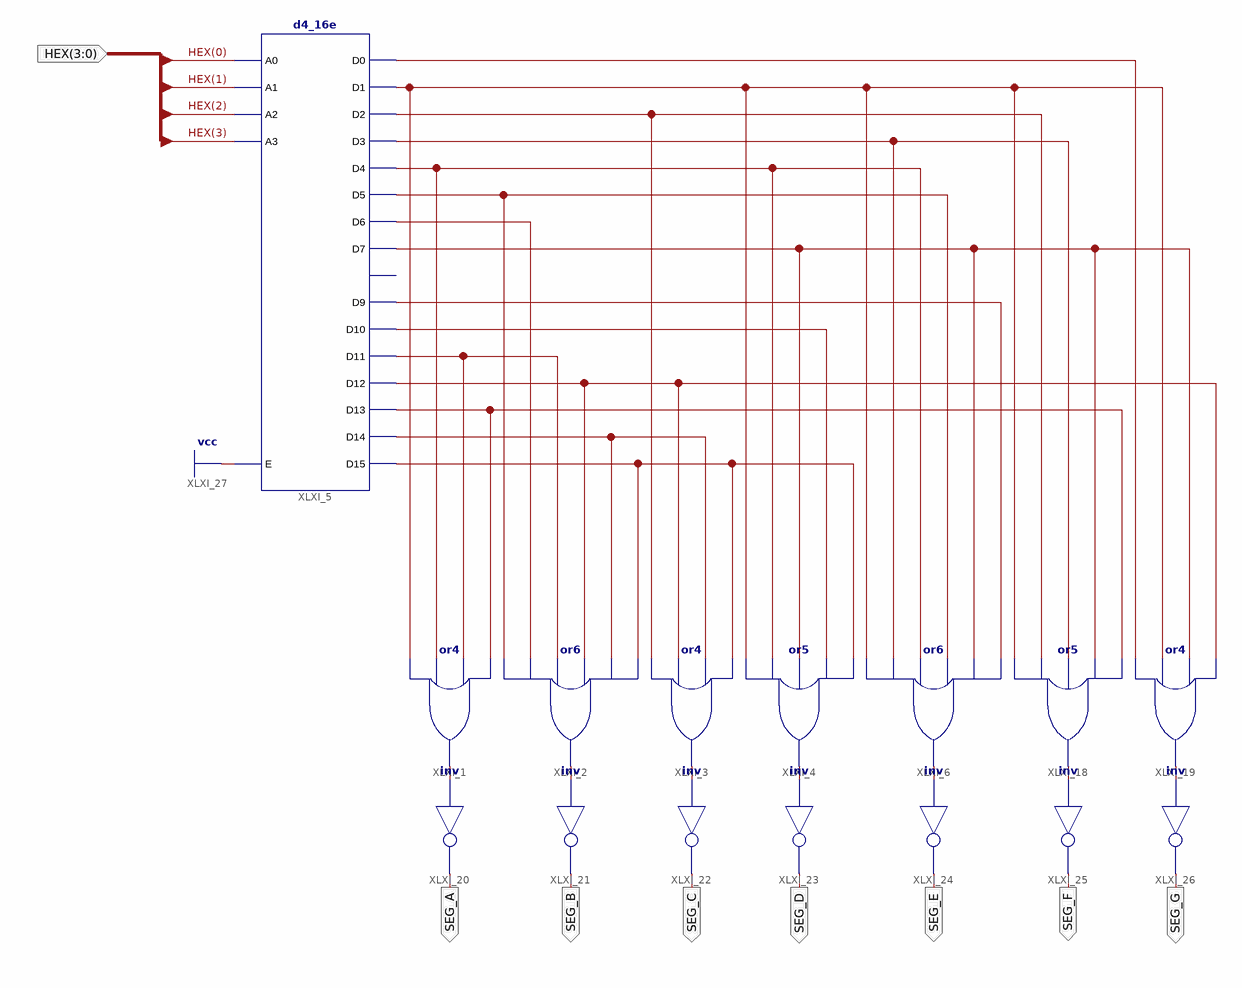
[diagram p0: schematic sheet 1]
// Xilinx ISE schematic HEX27SEG_Bus.sch (spartan6) as structural Verilog: 15 symbols, 8 ports
module HEX27SEG_Bus (
  input  [3:0] HEX,
  output SEG_A,
  output SEG_B,
  output SEG_C,
  output SEG_D,
  output SEG_E,
  output SEG_F,
  output SEG_G
);

  wire XLXN_1, XLXN_2, XLXN_4, XLXN_5, XLXN_6, XLXN_7, XLXN_8, XLXN_9, XLXN_11, XLXN_12, XLXN_13, XLXN_14,
       XLXN_35, XLXN_36, XLXN_53, XLXN_56, XLXN_57, XLXN_58, XLXN_59, XLXN_60, XLXN_61, XLXN_62;

  or XLXI_1 (XLXN_56, XLXN_2, XLXN_5, XLXN_36, XLXN_12);
  or XLXI_2 (XLXN_57, XLXN_6, XLXN_7, XLXN_36, XLXN_11, XLXN_13, XLXN_14);
  or XLXI_3 (XLXN_58, XLXN_35, XLXN_11, XLXN_13, XLXN_14);
  or XLXI_4 (XLXN_59, XLXN_2, XLXN_5, XLXN_53, XLXN_9, XLXN_14);
  d4_16e XLXI_5 (
    .A0(HEX[0]), .A1(HEX[1]), .A2(HEX[2]), .A3(HEX[3]), .E(1'b1), .D0(XLXN_1), .D1(XLXN_2), .D10(XLXN_9),
    .D11(XLXN_36), .D12(XLXN_11), .D13(XLXN_12), .D14(XLXN_13), .D15(XLXN_14), .D2(XLXN_35), .D3(XLXN_4),
    .D4(XLXN_5), .D5(XLXN_6), .D6(XLXN_7), .D7(XLXN_53), .D9(XLXN_8));  // open: D8
  or XLXI_6 (XLXN_60, XLXN_2, XLXN_4, XLXN_5, XLXN_6, XLXN_53, XLXN_8);
  or XLXI_18 (XLXN_61, XLXN_2, XLXN_35, XLXN_4, XLXN_53, XLXN_12);
  or XLXI_19 (XLXN_62, XLXN_1, XLXN_2, XLXN_53, XLXN_11);
  not XLXI_20 (SEG_A, XLXN_56);
  not XLXI_21 (SEG_B, XLXN_57);
  not XLXI_22 (SEG_C, XLXN_58);
  not XLXI_23 (SEG_D, XLXN_59);
  not XLXI_24 (SEG_E, XLXN_60);
  not XLXI_25 (SEG_F, XLXN_61);
  not XLXI_26 (SEG_G, XLXN_62);
endmodule
